# Altium schematic sheet mcu.SchDoc
size A
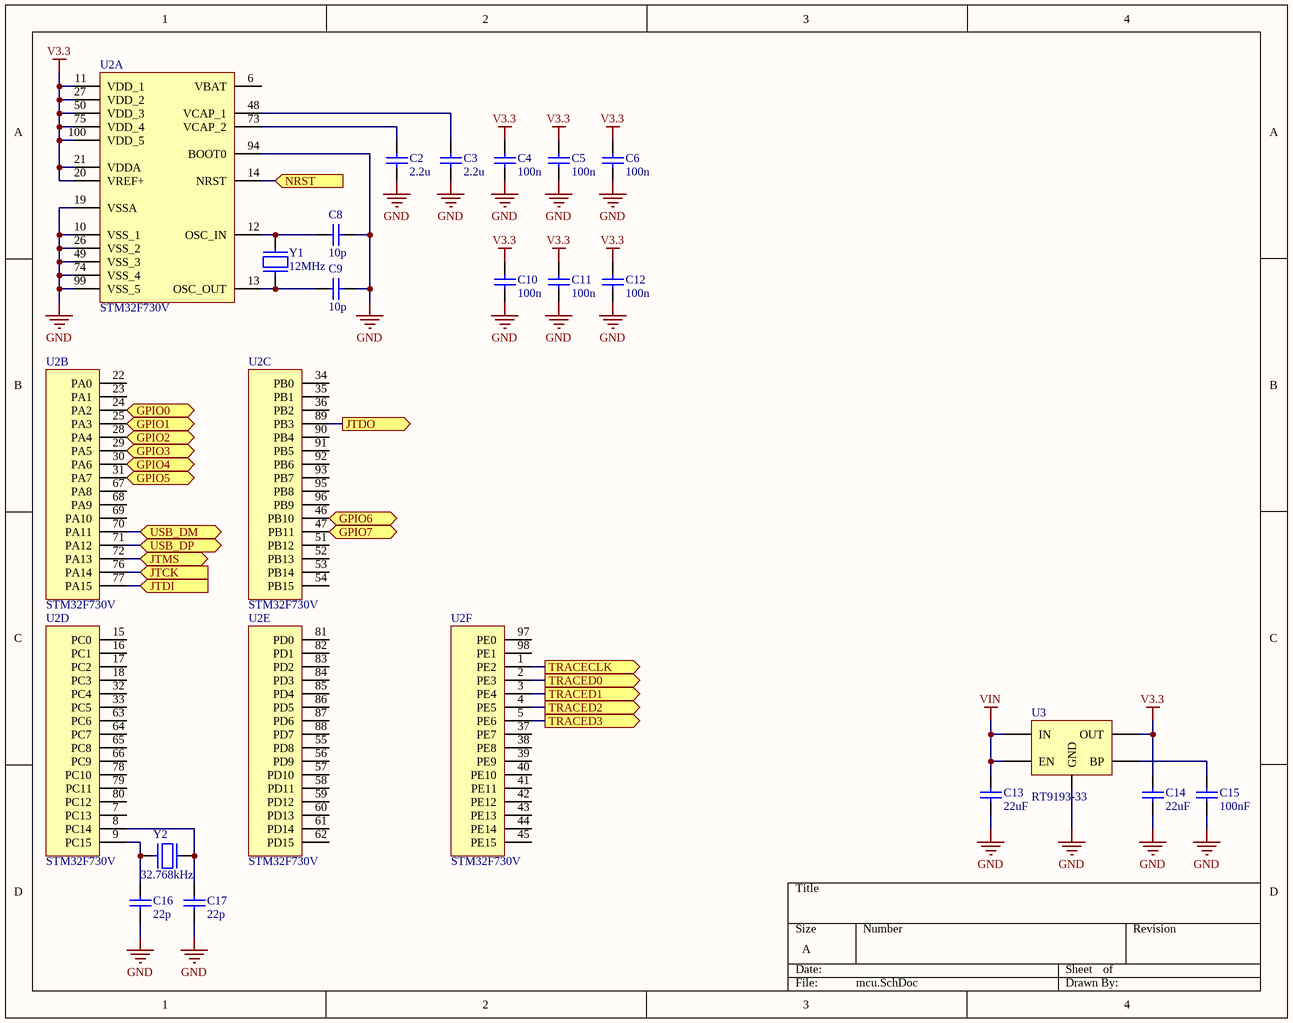
[diagram p0: mcu.SchDoc]

## Parts
C2  2.2u  [0402]
C3  2.2u  [0402]
C4  100n  [0402]
C5  100n  [0402]
C6  100n  [0402]
C8  10p  [0402]
C9  10p  [0402]
C10  100n  [0402]
C11  100n  [0402]
C12  100n  [0402]
C13  22uF  [0805]
C14  22uF  [0805]
C15  100nF  [0402]
C16  22p  [0402]
C17  22p  [0402]
U2  STM32F730V  [QFP100]  (parts A,B,C,D,E,F of 6)
U3  RT9193-33  [SOT23-5]
Y1  12MHz  [XTAL-2520-4SMD]
Y2  32.768kHz  [XTAL-3215]

## Ports
GPIO0 (bidir), GPIO1 (bidir), GPIO2 (bidir), GPIO3 (bidir), GPIO4 (bidir), GPIO5 (bidir), GPIO6 (bidir), GPIO7 (bidir), JTCK (in), JTDI (in), JTDO (out), JTMS (bidir), NRST (in), TRACECLK (out), TRACED0 (out), TRACED1 (out), TRACED2 (out), TRACED3 (out), USB_DM (bidir), USB_DP (bidir)

## Nets
GND: C2.1 C3.1 C4.1 C5.1 C6.1 C8.2 C9.2 C10.1 C11.1 C12.1 C13.1 C14.1 C15.1 C16.1 C17.1 U2.10(VSS_1) U2.19(VSSA) U2.26(VSS_2) U2.49(VSS_3) U2.74(VSS_4) U2.94(BOOT0) U2.99(VSS_5) U3.GND Y1.2 Y1.4
V3.3: C4.2 C5.2 C6.2 C10.2 C11.2 C12.2 C14.2 U2.11(VDD_1) U2.20(VREF+) U2.21(VDDA) U2.27(VDD_2) U2.50(VDD_3) U2.75(VDD_4) U2.100(VDD_5) U3.OUT
VIN: C13.2 U3.EN U3.IN
GPIO0: U2.24(PA2) ; port GPIO0
GPIO1: U2.25(PA3) ; port GPIO1
GPIO2: U2.28(PA4) ; port GPIO2
GPIO3: U2.29(PA5) ; port GPIO3
GPIO4: U2.30(PA6) ; port GPIO4
GPIO5: U2.31(PA7) ; port GPIO5
GPIO6: U2.46(PB10) ; port GPIO6
GPIO7: U2.47(PB11) ; port GPIO7
JTCK: U2.76(PA14) ; port JTCK
JTDI: U2.77(PA15) ; port JTDI
JTDO: U2.89(PB3) ; port JTDO
JTMS: U2.72(PA13) ; port JTMS
NRST: U2.14(NRST) ; port NRST
TRACECLK: U2.1(PE2) ; port TRACECLK
TRACED0: U2.2(PE3) ; port TRACED0
TRACED1: U2.3(PE4) ; port TRACED1
TRACED2: U2.4(PE5) ; port TRACED2
TRACED3: U2.5(PE6) ; port TRACED3
USB_DM: U2.70(PA11) ; port USB_DM
USB_DP: U2.71(PA12) ; port USB_DP
NetC2_2: C2.2 U2.73(VCAP_2)
NetC3_2: C3.2 U2.48(VCAP_1)
NetC8_1: C8.1 U2.12(OSC_IN) Y1.1
NetC9_1: C9.1 U2.13(OSC_OUT) Y1.3
NetC15_2: C15.2 U3.BP
NetC16_2: C16.2 U2.9(PC15) Y2.1
NetC17_2: C17.2 U2.8(PC14) Y2.2

Not connected (* = marked no-connect by the designer): U2 6(VBAT) 7(PC13) 15(PC0) 16(PC1) 17(PC2) 18(PC3) 22(PA0) 23(PA1) 32(PC4) 33(PC5) 34(PB0) 35(PB1) 36(PB2) 37(PE7) 38(PE8) 39(PE9) 40(PE10) 41(PE11) 42(PE12) 43(PE13) 44(PE14) 45(PE15) 51(PB12) 52(PB13) 53(PB14) 54(PB15) 55(PD8) 56(PD9) 57(PD10) 58(PD11) 59(PD12) 60(PD13) 61(PD14) 62(PD15) 63(PC6) 64(PC7) 65(PC8) 66(PC9) 67(PA8) 68(PA9) 69(PA10) 78(PC10) 79(PC11) 80(PC12) 81(PD0) 82(PD1) 83(PD2) 84(PD3) 85(PD4) 86(PD5) 87(PD6) 88(PD7) 90(PB4) 91(PB5) 92(PB6) 93(PB7) 95(PB8) 96(PB9) 97(PE0) 98(PE1)

## Library data of the parts
C2-C6 C8-C17 = Capacitor
  C2 C3: Value: 2.2u
  C4-C6 C10-C12: Value: 100n
  C8 C9: Value: 10p
  C13 C14: Value: 22uF
  C15: Value: 100nF
  C16 C17: Value: 22p
U3 = VREG_EN_BP: pin to pad: BP>4 EN>3 GND>2 IN>1 OUT>5
Y1 = XTAL_4SMD: Value: 12MHz
Y2 = XTAL: Value: 32.768kHz